# Altium schematic sheet Sheet1.SchDoc
size A4; SheetNumber: 1; SheetTotal: 1
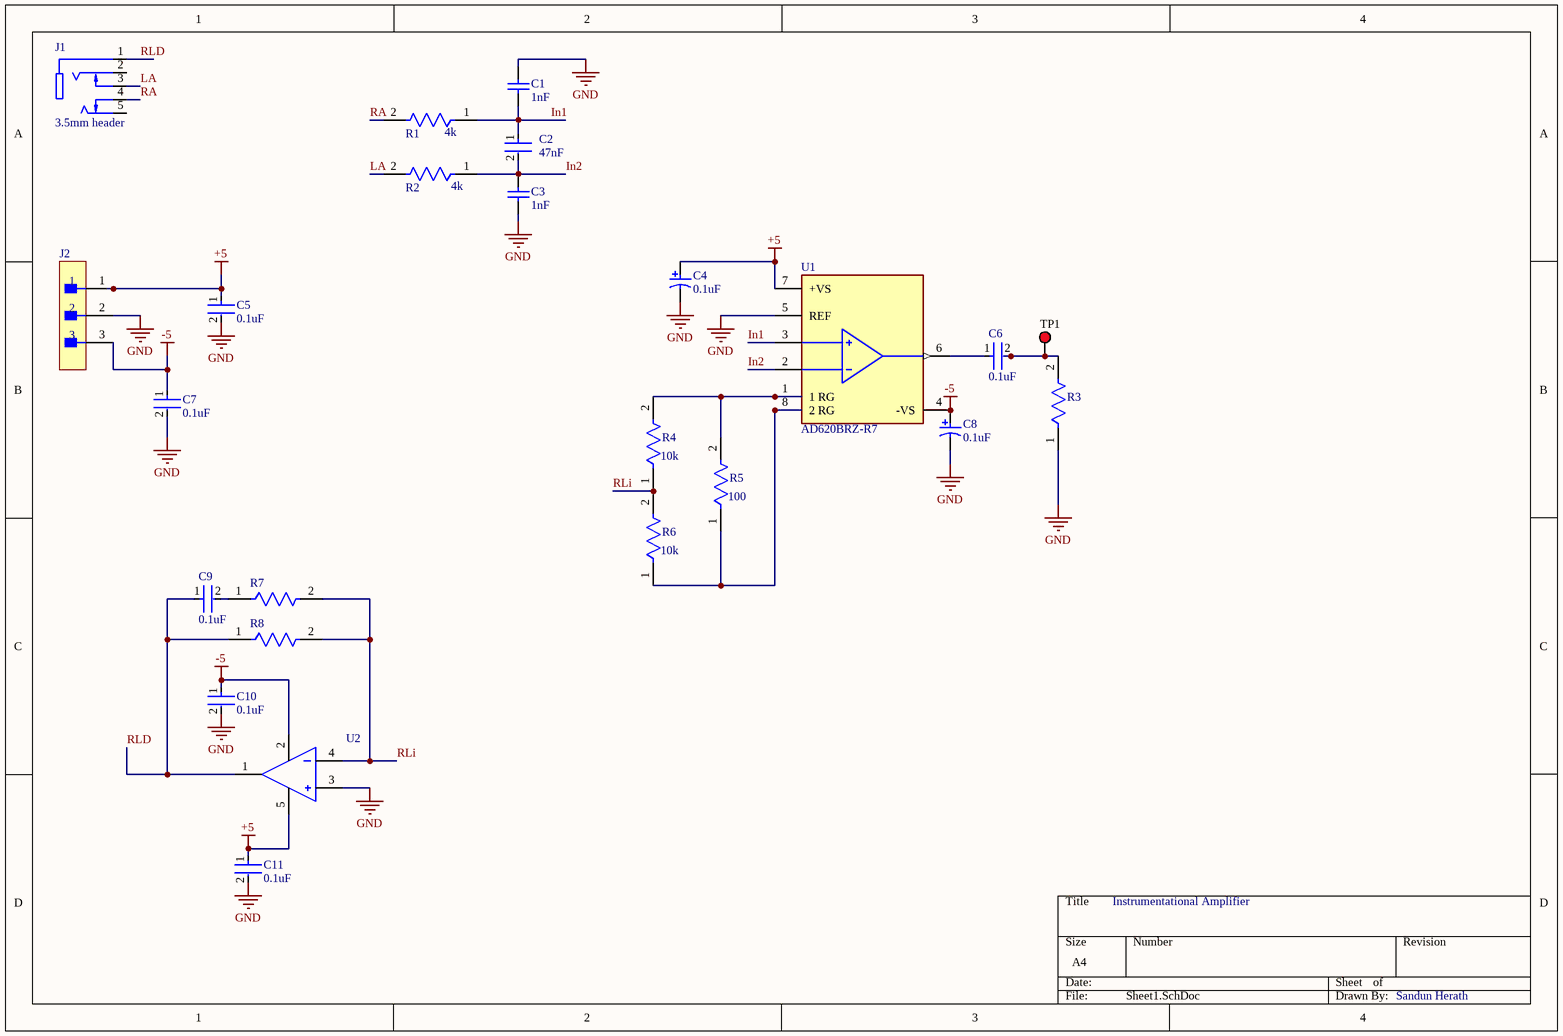
[diagram p0: Sheet1.SchDoc]

## Parts
C1  1nF  [CAPC0805(2012)145_L]
C2  47nF  [FP-GRM21B-0_1-IPC_C]
C3  1nF  [CAPC0805(2012)145_L]
C4  0.1uF  [VISH-TR8-M_L]
C5  0.1uF  [FP-CL21-IPC_A]
C6  0.1uF  [FP-CL21-IPC_A]
C7  0.1uF  [FP-CL21-IPC_A]
C8  0.1uF  [VISH-TR8-M_L]
C9  0.1uF  [FP-CL21-IPC_A]
C10  0.1uF  [FP-CL21-IPC_A]
C11  0.1uF  [FP-CL21-IPC_A]
J1  3.5mm header  [SWITCHCRAFT_35RAPC4BH3]
J2  M22-2510305  [FP-M22-2510305-MFG]  (value not drawn)
R1  4k  [FP-ERA6A-IPC_C]
R2  4k  [FP-ERA6A-IPC_C]
R3  ERA6AEB102V  [FP-ERA6A-IPC_C]  (value not drawn)
R4  10k  [FP-ERA6A-IPC_C]
R5  100  [FP-ERA6A-IPC_C]
R6  10k  [FP-ERA6A-IPC_C]
R7  ERA6AEB102V  [FP-ERA6A-IPC_C]  (value not drawn)
R8  ERA6AEB102V  [FP-ERA6A-IPC_C]  (value not drawn)
TP1  5010  [KSTN-5010_V]  (value not drawn)
U1  AD620BRZ-R7  [FP-R-8-IPC_C]
U2  TLV9151IDBVR  [FP-DBV0005A-IPC_A]  (value not drawn)

## Nets
+5: C4.1 C5.1 C11.1 J2.1 U1.7(+VS) U2.5(V+)
-5: C7.1 C8.1 C10.1 J2.3 U1.4(-VS) U2.2(V-)
GND: C1.2 C3.1 C4.2 C5.2 C7.2 C8.2 C10.2 C11.2 J2.2 R3.1 U1.5(REF) U2.3(IN+)
In1: C1.1 C2.1 R1.1 U1.3(+IN)
In2: C2.2 C3.2 R2.1 U1.2(-IN)
LA: J1.3 R2.2
RA: J1.4 R1.2
RLD: C9.1 J1.1 R8.1 U2.1(OUT)
RLi: R4.1 R6.2 R7.2 R8.2 U2.4(IN-)
NetC6_1: C6.1 U1.6(OUTPUT)
NetC6_2: C6.2 R3.2 TP1.1
NetC9_2: C9.2 R7.1
NetR4_2: R4.2 R5.2 U1.1(1_RG)
NetR5_1: R5.1 R6.1 U1.8(2_RG)

Not connected (* = marked no-connect by the designer): J1 2 5

## Notes on the sheet
- Instrumentational Amplifier
- Sandun Herath

## Library data of the parts
C1 C3 = CMP-1036-02976-1: CAP 1nF 50V ±5% 0805 (2012 Metric) Thickness 1.45mm SMD; Case-Metric: 2012; Tolerance: Â±5%; Case-EIA: 0805; Rated Voltage: 50 V; Technology: SMT; Max Thickness: 1.45 mm; Value: 1nF
C2 = CMP-06035-029151-1: Chip Multilayer Ceramic Capacitors for General Purpose, 0805, 47000pF, SL, +350/-1000ppm/°C, 5%, 50V,   GRM21B1X1H473JA01L; Packaging: Tape and Reel; Termination: SMD/SMT; Width: 0.049inch; Case Code (Metric): 2012; Thickness: 0.053inch; Tolerance: 5%; Voltage Rating: 50V; Case Code (Imperial): 0805; Max Operating Temperature: 125°C; Min Operating Temperature: -55°C; Case/Package: 0805; Mount: Surface Mount; Voltage Rating (DC): 50V; Length: 0.079inch; Capacitance: 47nF; Lead Free: Lead Free
C4 = CMP-2000-07316-1: Tantalum Capacitor, 10 uF, +/- 20%, 10 V, -55 to 125 degC, 2-Pin SMD (M), RoHS, Tape and Reel, TR8M106M010C2000; Manufacturer: Vishay; Capacitance: 10µF; Featured Product: TR8SeriesMoldedMicroTan™TantalumChipCapacitors; ESR (Equivalent Series Resistance): 2Ohm; Other Names: 718-1673-6; Catalog Drawings: TR8SeriesTR8SeriesBottom; Online Catalog: MICROTAN®TR8Series; Voltage - Rated: 10V; Type: Molded; Mounting Technology: SurfaceMount; Category: Capacitors; Lifetime @ Temp.: -; Package Reference: TR8-M; Size / Dimension: 0.063"Lx0.033"W(1.60mmx0.85mm); Operating Temperature: -55°C~125°C; Mounting Type: SurfaceMount; Lead Spacing: -; Tolerance: ±20%; Standard Package: 1; Datasheet URL: http://www.vishay.com/docs/40114/tr8.pdf; Package Description: 2-Pin Surface Mount Device, Body 1.6 x 0.85 mm; Height - Seated (Max): 0.035"(0.89mm); Family: TantalumCapacitors; Manufacturer Size Code: M; Series: MICROTAN®TR8; Packaging: Digi-Reel®; Manufacturer URL: http://www.vishay.com/; Datasheet Version: 03/2016; Package / Case: 0603(1608Metric); Features: GeneralPurpose
C5-C7 C9-C11 = CMP-13271-004391-1: CL21 Series 0805 100nF 25V ±20% Tolerance X7R Multilayer Ceramic Chip Capacitor, CL21B104MACNNNC; Package Quantity: 1; Lead Free: Lead Free; Capacitance: 100nF; Case Code (Imperial): 0805; Depth: 1.25mm; Case/Package: 0805; Height: 0.85mm; Width: 0.049inch; Tolerance: 20%; Length: 2mm; Series: CL; Case Code (Metric): 2012; Voltage Rating (DC): 25V; Packaging: Tape and Reel; RoHS Compliant: Yes; Mount: Surface Mount; Thickness: 0.037inch; Dielectric: X7R; Min Operating Temperature: -55°C; Max Operating Temperature: 125°C; Construction: Flat; Voltage Rating: 25V; Radiation Hardening: No
C8 = CMP-2000-07316-1: Tantalum Capacitor, 10 uF, +/- 20%, 10 V, -55 to 125 degC, 2-Pin SMD (M), RoHS, Tape and Reel,   TR8M106M010C2000; Manufacturer: Vishay; Capacitance: 10µF; Featured Product: TR8SeriesMoldedMicroTan™TantalumChipCapacitors; ESR (Equivalent Series Resistance): 2Ohm; Other Names: 718-1673-6; Catalog Drawings: TR8SeriesTR8SeriesBottom; Online Catalog: MICROTAN®TR8Series; Voltage - Rated: 10V; Type: Molded; Mounting Technology: SurfaceMount; Category: Capacitors; Lifetime @ Temp.: -; Package Reference: TR8-M; Size / Dimension: 0.063"Lx0.033"W(1.60mmx0.85mm); Operating Temperature: -55°C~125°C; Mounting Type: SurfaceMount; Lead Spacing: -; Tolerance: ±20%; Standard Package: 1; Datasheet URL: http://www.vishay.com/docs/40114/tr8.pdf; Package Description: 2-Pin Surface Mount Device, Body 1.6 x 0.85 mm; Height - Seated (Max): 0.035"(0.89mm); Family: TantalumCapacitors; Manufacturer Size Code: M; Series: MICROTAN®TR8; Packaging: Digi-Reel®; Manufacturer URL: http://www.vishay.com/; Datasheet Version: 03/2016; Package / Case: 0603(1608Metric); Features: GeneralPurpose
J1 = 35RAPC4BH3: 3.50mm (0.141", 1/8", Mini Plug) - Headphone Phone Jack Stereo (3 Conductor, TRS) Connector Solder; Package: None; Price: None; Value: *; MP: 35RAPC4BH3; Availability: Unavailable
J2 = CMP-00671-05385874-1: M22-2510305 Conn Unshrouded Header M 3 POS 2mm Solder ST Top Entry Thru-Hole Bulk/Loose; Current Rating: 2A; Number of Contacts: 3; Connector Type: Male Pin; Contact Resistance: 20mΩ; Gender: Male; Voltage Rating: 650V; Max Current Rating: 1A; Number of Rows: 1; Color: Black; REACH SVHC: No SVHC; Min Operating Temperature: -40°C; Max Operating Temperature: 105°C; Orientation: Straight; Depth: 2mm; Contact Material: Gold, Nickel; Length: 6mm; Pitch: 2mm; Contact Plating: Gold; Mount: Through Hole; RoHS: Compliant; Termination: Solder; Height: 5.45mm; Radiation Hardening: No; Case/Package: SIL; Number of Positions: 3; Housing Material: Nylon; Housing Color: Black; Contact Mating Length: 3.5052mm
R1 R2 R5 R6 = CMP-2001-00581-2: RES 1K OHM 0.1% 1/8W 0805,  ERA6AEB102V; Temperature Coefficient: 25ppm/°C; Resistance: 1kR; Working Voltage: 100V; Max Power Dissipation: 125mW; Height: 0.5mm; Technology: THIN FILM; REACH SVHC: No SVHC; Packaging: Tape and Reel; Length: 2mm; Width: 1.25mm; Resistance Tolerance: 0.1%; Series: ERA-6A; Resistor Type: Thin Film; Number of Pins: 2; Case Code (Metric): 2012; Voltage Rating: 100V; Radiation Hardening: No; Construction: Rectangular; Mount: Surface Mount; Number of Terminations: 2; Case/Package: 0805; Min Operating Temperature: -55°C; Military Standard: Not; RoHS Compliant: Yes; Termination: SMD/SMT; Case Code (Imperial): 0805; Depth: 1.25mm; Power Rating: 125mW; Max Operating Temperature: 155°C; Contact Plating: Tin; Package Quantity: 5000; Tolerance: 0.1%
R3 R7 R8 = CMP-2001-00581-2: RES 1K OHM 0.1% 1/8W 0805; Temperature Coefficient: 25ppm/°C; Resistance: 1kR; Working Voltage: 100V; Max Power Dissipation: 125mW; Height: 0.5mm; Technology: THIN FILM; REACH SVHC: No SVHC; Packaging: Tape and Reel; Length: 2mm; Width: 1.25mm; Resistance Tolerance: 0.1%; Series: ERA-6A; Resistor Type: Thin Film; Number of Pins: 2; Case Code (Metric): 2012; Voltage Rating: 100V; Radiation Hardening: No; Construction: Rectangular; Mount: Surface Mount; Number of Terminations: 2; Case/Package: 0805; Min Operating Temperature: -55°C; Military Standard: Not; RoHS Compliant: Yes; Termination: SMD/SMT; Case Code (Imperial): 0805; Depth: 1.25mm; Power Rating: 125mW; Max Operating Temperature: 155°C; Contact Plating: Tin; Package Quantity: 5000; Tolerance: 0.1%
R4 = CMP-2001-00581-2: RES 1K OHM 0.1% 1/8W 0805,    ERA6AEB102V; Temperature Coefficient: 25ppm/°C; Resistance: 1kR; Working Voltage: 100V; Max Power Dissipation: 125mW; Height: 0.5mm; Technology: THIN FILM; REACH SVHC: No SVHC; Packaging: Tape and Reel; Length: 2mm; Width: 1.25mm; Resistance Tolerance: 0.1%; Series: ERA-6A; Resistor Type: Thin Film; Number of Pins: 2; Case Code (Metric): 2012; Voltage Rating: 100V; Radiation Hardening: No; Construction: Rectangular; Mount: Surface Mount; Number of Terminations: 2; Case/Package: 0805; Min Operating Temperature: -55°C; Military Standard: Not; RoHS Compliant: Yes; Termination: SMD/SMT; Case Code (Imperial): 0805; Depth: 1.25mm; Power Rating: 125mW; Max Operating Temperature: 155°C; Contact Plating: Tin; Package Quantity: 5000; Tolerance: 0.1%
TP1 = CMP-1672-00002-4: Test Point, Red, Through Hole, RoHS, Bulk; Manufacturer: Keystone; Contact Material: Bronze; Mounting Technology: Through Hole; RoHSCompliant: true; Pins: 1; Package Quantity: 100; ComponentLink2Description: Datasheet; Height: 8.12 mm; ComponentLink1URL: http://www.keyelco.com/; DatasheetVersion: Rev. F, 12/2013; Mount: Through Hole; PackageReference: 5010; Contact Plating: Silver; Packaging: Bulk; Colour: Red; REACH SVHC: No SVHC; PackageDescription: 1-Pin Through Hole Device, Dia 3.17 mm; ComponentLink2URL: http://www.keyelco.com/product-pdf.cfm?p=1319; ComponentLink1Description: Manufacturer URL
U1 = CMP-09116-000394-1: IC INST AMP 1 CIRCUIT 8SOIC; Operating Supply Voltage: 18V; Max Power Dissipation: 650mW; Operating Supply Current: 1.3mA; Number of Channels: 1; Amplifier Type: INSTRUMENTATION AMPLIFIER; Input Offset Voltage (Vos): 30mV; Min Supply Voltage: 4.6V; Output Current per Channel: 18mA; Input Resistance: 10GR; Min Dual Supply Voltage: 2.3V; Common Mode Rejection Ratio: 93dB; Slew Rate: 1.2V/µs; -3db Bandwidth: 1MHz; Input Bias Current: 1nA; Number of Pins: 8; Case/Package: SOIC; Lead Free: Contains Lead; Max Operating Temperature: 125°C; Package Quantity: 1; Radiation Hardening: No; Contact Plating: Tin; Mount: Surface Mount; Min Operating Temperature: -55°C; Power Dissipation: 650mW; Nominal Supply Current: 1.3mA; Packaging: Tape and Reel; Number of Circuits: 1; RoHS Compliant: Yes; Number of Elements: 1; Max Dual Supply Voltage: 18V; Series: -
U2 = CMP-04895-000336-1: OPAMP